# EAGLE design fab-slider-shield-v2_driver-only (EAGLE 9.2.0)
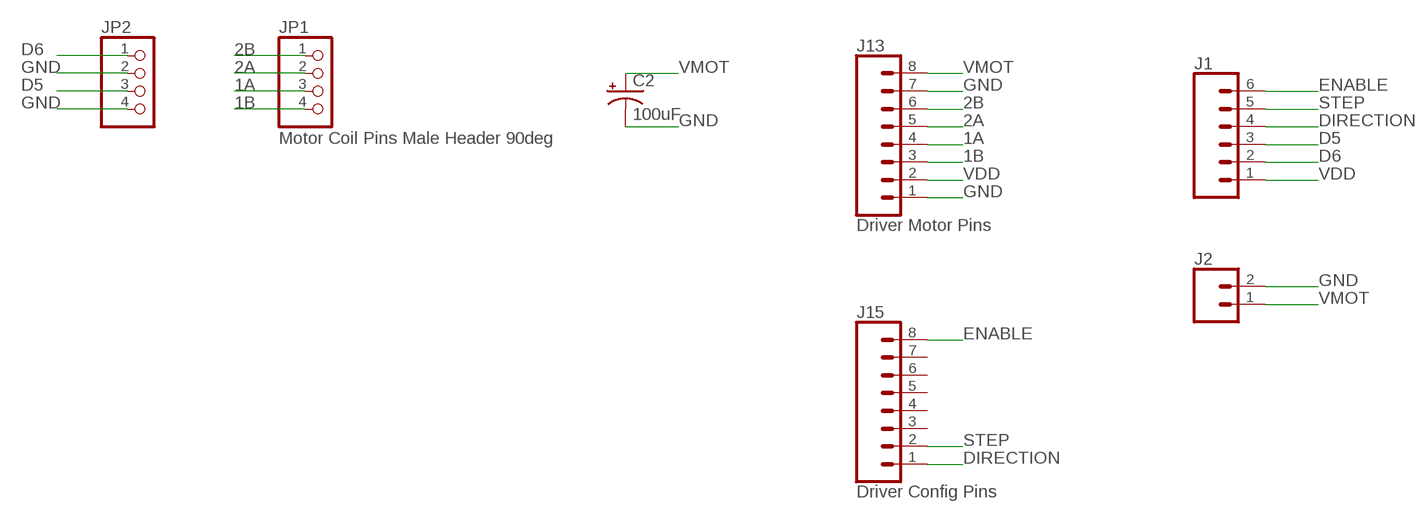
[diagram p0: schematic, sheet 1]

## Parts
C2  100uF  100UF-POLAR-RADIAL-2.5MM-25V-20%  [CPOL-RADIAL-2.5MM-6.5MM]
J1  CONN_06LONGPADS  [1X06_LONGPADS]
J2  CONN_02PTH3  [1X02_LONGPADS]
J13  Driver Motor Pins  CONN_08LONGPADS  [1X08_LONGPADS]
J15  Driver Config Pins  CONN_08LONGPADS  [1X08_LONGPADS]
JP1  Motor Coil Pins Male Header 90deg  PINHD-1X4/90  [1X04/90]
JP2  PINHD-1X4/90  [1X04/90]

## Nets
1A: J13.4 JP1.3
1B: J13.3 JP1.4
2A: J13.5 JP1.2
2B: J13.6 JP1.1
D5: J1.3 JP2.3
D6: J1.2 JP2.1
DIRECTION: J1.4 J15.1
ENABLE: J1.6 J15.8
GND: C2.2(-) J2.2 J13.1 J13.7 JP2.2 JP2.4
STEP: J1.5 J15.2
VDD: J1.1 J13.2
VMOT: C2.1(+) J2.1 J13.8
Unconnected: J15.3 J15.4 J15.5 J15.6 J15.7

## Library data of the parts
C2 = SparkFun-Capacitors:100UF-POLAR: 100µF polarized capacitors A capacitor is a passive two-terminal electrical component used to store electrical energy temporarily in an electric field.; PROD_ID: CAP-08439
J1 = SparkFun-Connectors:CONN_06: Multi connection point. Often used as Generic Header-pin footprint for 0.1 inch spaced/style header connections On any of the 0.1 inch spaced packages, you can populate with these: Break Away Headers - Straight <https://www.sparkfun.com/products/116> (PRT-00116) Break Away Male Headers - Right Angle <https://www.sparkfun.com/products/553> (PRT-00553) Female Headers <https://www.sparkfun.com/products/115> (PRT-00115) Break Away Headers - Machine Pin <https://www.sparkfun.com/products/117> (PRT-00117) Break Away Female Headers - Swiss Machine Pin <https://www.sparkfun.com/products/743> (PRT-00743) Arduino Stackable Header - 6 Pin <https://www.sparkfun.com/products/9280> (PRT-09280) For SCREWTERMINALS and SPRING TERMINALS visit here: Screw Terimnals on SparkFun.com <https://www.sparkfun.com/search/results?term=Screw+Terminals> (5mm/3.5mm/2.54mm spacing) This device is also useful as a general connection point to wire up your design to another part of your project. Our various solder wires solder well into these plated through hole pads. Hook-Up Wire - Assortment (Stranded, 22 AWG) <https://www.sparkfun.com/products/11375> (PRT-11375) Hook-Up Wire - Assortment (Solid Core, 22 AWG) <https://www.sparkfun.com/products/11367> (PRT-11367) View the entire wire category on our website here <https://www.sparkfun.com/categories/141>
J2 = SparkFun-Connectors:CONN_02: Multi connection point. Often used as Generic Header-pin footprint for 0.1 inch spaced/style header connections On any of the 0.1 inch spaced packages, you can populate with these: Break Away Headers - Straight <https://www.sparkfun.com/products/116> (PRT-00116) Break Away Male Headers - Right Angle <https://www.sparkfun.com/products/553> (PRT-00553) Female Headers <https://www.sparkfun.com/products/115> (PRT-00115) Break Away Headers - Machine Pin <https://www.sparkfun.com/products/117> (PRT-00117) Break Away Female Headers - Swiss Machine Pin <https://www.sparkfun.com/products/743> (PRT-00743) For SCREWTERMINALS and SPRING TERMINALS visit here: Screw Terimnals on SparkFun.com <https://www.sparkfun.com/search/results?term=Screw+Terminals> (5mm/3.5mm/2.54mm spacing) This device is also useful as a general connection point to wire up your design to another part of your project. Our various solder wires solder well into these plated through hole pads. Hook-Up Wire - Assortment (Stranded, 22 AWG) <https://www.sparkfun.com/products/11375> (PRT-11375) Hook-Up Wire - Assortment (Solid Core, 22 AWG) <https://www.sparkfun.com/products/11367> (PRT-11367) View the entire wire category on our website here <https://www.sparkfun.com/categories/141> Special notes: Molex polarized connector foot print use with: PRT-08233 with associated crimp pins and housings. 2.54_SCREWTERM for use with PRT-10571. 3.5mm Screw Terminal footprints for PRT-08084 5mm Screw Terminal footprints for use with PRT-08432
J13 J15 = SparkFun-Connectors:CONN_08: Multi connection point. Often used as Generic Header-pin footprint for 0.1 inch spaced/style header connections On any of the 0.1 inch spaced packages, you can populate with these: Break Away Headers - Straight <https://www.sparkfun.com/products/116> (PRT-00116) Break Away Male Headers - Right Angle <https://www.sparkfun.com/products/553> (PRT-00553) Female Headers <https://www.sparkfun.com/products/115> (PRT-00115) Break Away Headers - Machine Pin <https://www.sparkfun.com/products/117> (PRT-00117) Break Away Female Headers - Swiss Machine Pin <https://www.sparkfun.com/products/743> (PRT-00743) Arduino Stackable Header - 8 Pin <https://www.sparkfun.com/products/9279> (PRT-09279) For SCREWTERMINALS and SPRING TERMINALS visit here: Screw Terimnals on SparkFun.com <https://www.sparkfun.com/search/results?term=Screw+Terminals> (5mm/3.5mm/2.54mm spacing) This device is also useful as a general connection point to wire up your design to another part of your project. Our various solder wires solder well into these plated through hole pads. Hook-Up Wire - Assortment (Stranded, 22 AWG) <https://www.sparkfun.com/products/11375> (PRT-11375) Hook-Up Wire - Assortment (Solid Core, 22 AWG) <https://www.sparkfun.com/products/11367> (PRT-11367) View the entire wire category on our website here <https://www.sparkfun.com/categories/141> Special notes: Molex polarized connector foot print use with SKU : PRT-08231 with associated crimp pins and housings. 1MM SMD Version SKU: PRT-10208 NOTES ON THE VARIANTS LOCK and LOCK_LONGPADS... This footprint was designed to help hold the alignment of a through-hole component (i.e. 6-pin header) while soldering it into place. You may notice that each hole has been shifted either up or down by 0.005 of an inch from it's more standard position (which is a perfectly straight line). This slight alteration caused the pins (the squares in the middle) to touch the edges of the holes. Because they are alternating, it causes a "brace" to hold the component in place. 0.005 has proven to be the perfect amount of "off-center" position when using our standard breakaway headers. Although looks a little odd when you look at the bare footprint, once you have a header in there, the alteration is very hard to notice. Also,if you push a header all the way into place, it is covered up entirely on the bottom side.
JP1 JP2 = pinhead:PINHD-1X4: PIN HEADER

## Board
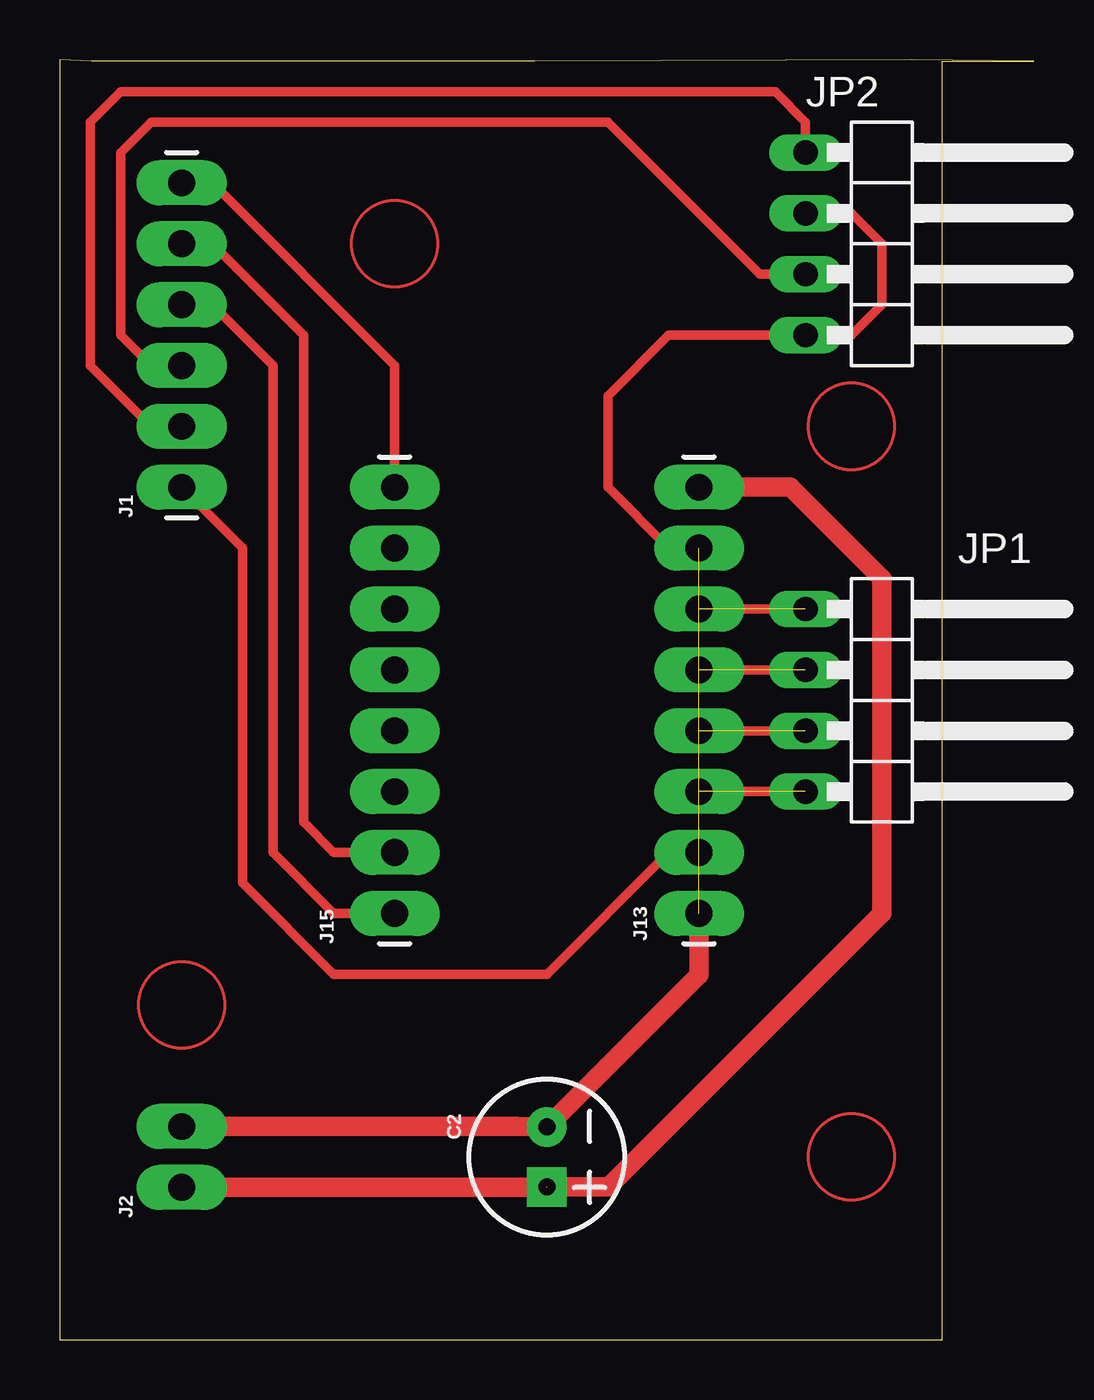
[diagram p1: board, top side]

Size 40.64 x 53.39 mm. Coordinates in mm from the lower left corner, seen from the top.
Outline: 0,0 36.83,0 36.83,53.34 40.64,53.34 35.54,53.39 19.81,53.34 1.32,53.34 0,53.39 0,0
Copper layers (1*16): Top 0.035mm / dielectric 1.5mm / Bottom 0.035mm
Design rules "default": minimum track width 6mil, minimum drill 0.35mm, track to track 6mil, track to pad 6mil, pad to pad 6mil, via to via 6mil, smd to smd 6mil, copper to edge 40mil, drill to drill 6mil, minimum pad ring 10mil, minimum via ring 8mil, stop-mask expansion 4mil, vias tented up to drill 0mil, thermal gap 10mil

### Footprints (pad centres in the part's own frame; a part is rotated, then mirrored left to right if it is on the bottom)
CPOL-RADIAL-2.5MM-6.5MM = drill 0.7 pad 1.651 square: 1 1.25,0 | drill 0.7 pad 1.651: 2 -1.25,0
1X06_LONGPADS = drill 1.118 pad 1.88 long: 1 0,0; 2 2.54,0; 3 5.08,0; 4 7.62,0; 5 10.16,0; 6 12.7,0
1X02_LONGPADS = drill 1.118 pad 1.88 long: 1 0,0; 2 2.54,0
1X08_LONGPADS = drill 1.118 pad 1.88 long: 1 0,0; 2 2.54,0; 3 5.08,0; 4 7.62,0; 5 10.16,0; 6 12.7,0; 7 15.24,0; 8 17.78,0
1X04/90 = drill 1.016 long: 1 -3.81,-3.81; 2 -1.27,-3.81; 3 1.27,-3.81; 4 3.81,-3.81

### Placement (x,y rotation side)
C2  20.32,7.62 270 top
J1  5.08,35.56 90 top
J2  5.08,6.35 90 top
J13  26.67,17.78 90 top
J15  13.97,17.78 90 top
JP1  34.93,26.67 270 top
JP2  34.93,45.72 270 top

### Tracks (layer width: path | path; a pad name or v marks a point on that pad's centre or on a via)
1A  (1 unrouted)
  Top 0.406: JP1.3 J13.4
1B  (1 unrouted)
  Top 0.406: JP1.4 J13.3
2A  (1 unrouted)
  Top 0.406: JP1.2 J13.5
2B  (1 unrouted)
  Top 0.406: JP1.1 J13.6
D5
  Top 0.406: J1.3 3.81,40.64 2.54,41.91 2.54,49.53 3.81,50.8 22.86,50.8 29.21,44.45 JP2.3
D6
  Top 0.406: J1.2 3.81,38.1 1.27,40.64 1.27,50.8 2.54,52.07 29.84,52.07 31.12,50.8 JP2.1
DIRECTION
  Top 0.406: J1.4 6.35,43.18 8.89,40.64 8.89,20.32 11.43,17.78 J15.1
ENABLE
  Top 0.406: J1.6 6.35,48.26 13.97,40.64 J15.8
GND  (1 unrouted)
  Top 0.406: J13.7 25.4,33.02 22.86,35.56 22.86,39.37 25.4,41.91 JP2.4 33.02,41.91 34.29,43.18 34.29,45.72 33.02,46.99 JP2.2
  Top 0.813: J2.2 19.05,8.89 C2.2 26.67,15.22 J13.1 26.67,15.74
STEP
  Top 0.406: J1.5 6.35,45.72 10.16,41.91 10.16,21.59 11.43,20.32 J15.2
VDD
  Top 0.406: J13.2 25.4,20.32 20.32,15.24 11.43,15.24 7.62,19.05 7.62,33.02 J1.1
VMOT  (1 unrouted)
  Top 0.813: 20.32,6.35 J2.1 | J13.8 30.48,35.56 34.29,31.75 34.29,17.78 22.88,6.37 C2.1
(copper drawn outside any net)
  shapes: Top circle x4